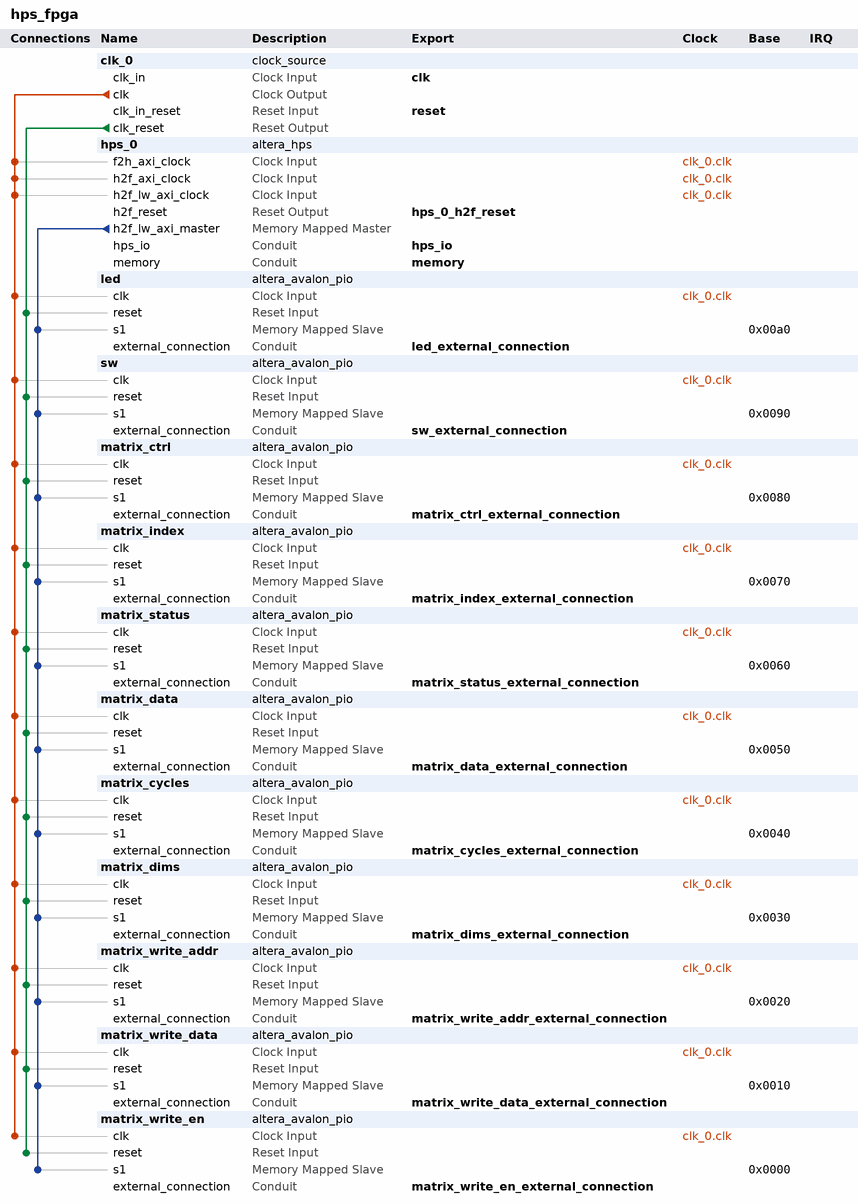
[diagram p0: system contents]
# Platform Designer (Qsys) system hps_fpga, Cyclone V 5CSEMA5F31C6
# Parameters at their usual value, and those the tool derives, are not listed.
package require -exact qsys 17.1
create_system hps_fpga
set_project_property DEVICE_FAMILY {Cyclone V}
set_project_property DEVICE 5CSEMA5F31C6

add_instance clk_0 clock_source 17.1
set_instance_parameter_value clk_0 clockFrequency 50000000

add_instance hps_0 altera_hps 17.1
set_instance_parameter_value hps_0 EMAC1_Mode RGMII
set_instance_parameter_value hps_0 EMAC1_PinMuxing {HPS I/O Set 0}
set_instance_parameter_value hps_0 F2SCLK_COLDRST_Enable false
set_instance_parameter_value hps_0 F2SCLK_DBGRST_Enable false
set_instance_parameter_value hps_0 F2SCLK_WARMRST_Enable false
set_instance_parameter_value hps_0 F2SINTERRUPT_Enable false
set_instance_parameter_value hps_0 F2S_Width 2
set_instance_parameter_value hps_0 FPGA_PERIPHERAL_OUTPUT_CLOCK_FREQ_EMAC0_GTX_CLK 100
set_instance_parameter_value hps_0 FPGA_PERIPHERAL_OUTPUT_CLOCK_FREQ_EMAC0_MD_CLK 100.0
set_instance_parameter_value hps_0 FPGA_PERIPHERAL_OUTPUT_CLOCK_FREQ_EMAC1_GTX_CLK 100
set_instance_parameter_value hps_0 FPGA_PERIPHERAL_OUTPUT_CLOCK_FREQ_EMAC1_MD_CLK 100.0
set_instance_parameter_value hps_0 HPS_PROTOCOL DDR3
set_instance_parameter_value hps_0 I2C0_Mode N/A
set_instance_parameter_value hps_0 I2C0_PinMuxing Unused
set_instance_parameter_value hps_0 I2C1_Mode N/A
set_instance_parameter_value hps_0 I2C1_PinMuxing Unused
set_instance_parameter_value hps_0 LWH2F_Enable true
set_instance_parameter_value hps_0 MEM_BANKADDR_WIDTH 3
set_instance_parameter_value hps_0 MEM_CLK_FREQ 400.0
set_instance_parameter_value hps_0 MEM_COL_ADDR_WIDTH 10
set_instance_parameter_value hps_0 MEM_DQ_WIDTH 32
set_instance_parameter_value hps_0 MEM_DRV_STR RZQ/7
set_instance_parameter_value hps_0 MEM_ROW_ADDR_WIDTH 15
set_instance_parameter_value hps_0 MEM_RTT_NOM RZQ/4
set_instance_parameter_value hps_0 MEM_RTT_WR {Dynamic ODT off}
set_instance_parameter_value hps_0 MEM_TCL 11
set_instance_parameter_value hps_0 MEM_TFAW_NS 30.0
set_instance_parameter_value hps_0 MEM_TRAS_NS 35.0
set_instance_parameter_value hps_0 MEM_TRCD_NS 13.75
set_instance_parameter_value hps_0 MEM_TRFC_NS 260.0
set_instance_parameter_value hps_0 MEM_TRP_NS 13.75
set_instance_parameter_value hps_0 MEM_VENDOR JEDEC
set_instance_parameter_value hps_0 MEM_WTCL 8
set_instance_parameter_value hps_0 QSPI_Mode N/A
set_instance_parameter_value hps_0 QSPI_PinMuxing Unused
set_instance_parameter_value hps_0 REF_CLK_FREQ 25.0
set_instance_parameter_value hps_0 S2FCLK_USER2CLK 5
set_instance_parameter_value hps_0 S2F_Width 2
set_instance_parameter_value hps_0 SDIO_Mode {4-bit Data}
set_instance_parameter_value hps_0 SDIO_PinMuxing {HPS I/O Set 0}
set_instance_parameter_value hps_0 SPIM1_Mode N/A
set_instance_parameter_value hps_0 SPIM1_PinMuxing Unused
set_instance_parameter_value hps_0 STM_Enable false
set_instance_parameter_value hps_0 TIMING_BOARD_AC_SKEW 0.03
set_instance_parameter_value hps_0 TIMING_BOARD_AC_TO_CK_SKEW 0.0
set_instance_parameter_value hps_0 TIMING_BOARD_DQ_TO_DQS_SKEW 0.0
set_instance_parameter_value hps_0 TIMING_BOARD_MAX_CK_DELAY 0.03
set_instance_parameter_value hps_0 TIMING_BOARD_MAX_DQS_DELAY 0.02
set_instance_parameter_value hps_0 TIMING_BOARD_SKEW_BETWEEN_DQS 0.08
set_instance_parameter_value hps_0 TIMING_BOARD_SKEW_CKDQS_DIMM_MAX 0.16
set_instance_parameter_value hps_0 TIMING_BOARD_SKEW_CKDQS_DIMM_MIN 0.09
set_instance_parameter_value hps_0 TIMING_BOARD_SKEW_WITHIN_DQS 0.01
set_instance_parameter_value hps_0 TIMING_TDH 65
set_instance_parameter_value hps_0 TIMING_TDQSCK 255
set_instance_parameter_value hps_0 TIMING_TDQSQ 125
set_instance_parameter_value hps_0 TIMING_TDS 30
set_instance_parameter_value hps_0 TIMING_TIH 140
set_instance_parameter_value hps_0 TIMING_TIS 180
set_instance_parameter_value hps_0 TIMING_TQSH 0.4
set_instance_parameter_value hps_0 UART0_Mode {No Flow Control}
set_instance_parameter_value hps_0 UART0_PinMuxing {HPS I/O Set 0}
set_instance_parameter_value hps_0 USB1_Mode SDR
set_instance_parameter_value hps_0 USB1_PinMuxing {HPS I/O Set 0}
set_instance_parameter_value hps_0 desired_cfg_clk_mhz 100.0
set_instance_parameter_value hps_0 desired_qspi_clk_mhz 400.0

add_instance led altera_avalon_pio 17.1
set_instance_parameter_value led direction Output
set_instance_parameter_value led resetValue 1023
set_instance_parameter_value led width 10

add_instance sw altera_avalon_pio 17.1
set_instance_parameter_value sw direction Input
set_instance_parameter_value sw width 10

add_instance matrix_ctrl altera_avalon_pio 17.1
set_instance_parameter_value matrix_ctrl direction Output
set_instance_parameter_value matrix_ctrl width 32

add_instance matrix_index altera_avalon_pio 17.1
set_instance_parameter_value matrix_index direction Output
set_instance_parameter_value matrix_index width 6

add_instance matrix_status altera_avalon_pio 17.1
set_instance_parameter_value matrix_status direction Input
set_instance_parameter_value matrix_status width 32

add_instance matrix_data altera_avalon_pio 17.1
set_instance_parameter_value matrix_data direction Input
set_instance_parameter_value matrix_data width 32

add_instance matrix_cycles altera_avalon_pio 17.1
set_instance_parameter_value matrix_cycles direction Input
set_instance_parameter_value matrix_cycles width 32

add_instance matrix_dims altera_avalon_pio 17.1
set_instance_parameter_value matrix_dims direction Output
set_instance_parameter_value matrix_dims width 32

add_instance matrix_write_addr altera_avalon_pio 17.1
set_instance_parameter_value matrix_write_addr direction Output
set_instance_parameter_value matrix_write_addr width 32

add_instance matrix_write_data altera_avalon_pio 17.1
set_instance_parameter_value matrix_write_data direction Output
set_instance_parameter_value matrix_write_data width 32

add_instance matrix_write_en altera_avalon_pio 17.1
set_instance_parameter_value matrix_write_en direction Output
set_instance_parameter_value matrix_write_en width 31

# connections
add_connection clk_0.clk hps_0.f2h_axi_clock clock
add_connection clk_0.clk hps_0.h2f_axi_clock clock
add_connection clk_0.clk hps_0.h2f_lw_axi_clock clock
add_connection clk_0.clk led.clk clock
add_connection clk_0.clk matrix_ctrl.clk clock
add_connection clk_0.clk matrix_cycles.clk clock
add_connection clk_0.clk matrix_data.clk clock
add_connection clk_0.clk matrix_dims.clk clock
add_connection clk_0.clk matrix_index.clk clock
add_connection clk_0.clk matrix_status.clk clock
add_connection clk_0.clk matrix_write_addr.clk clock
add_connection clk_0.clk matrix_write_data.clk clock
add_connection clk_0.clk matrix_write_en.clk clock
add_connection clk_0.clk sw.clk clock
add_connection clk_0.clk_reset led.reset reset
add_connection clk_0.clk_reset matrix_ctrl.reset reset
add_connection clk_0.clk_reset matrix_cycles.reset reset
add_connection clk_0.clk_reset matrix_data.reset reset
add_connection clk_0.clk_reset matrix_dims.reset reset
add_connection clk_0.clk_reset matrix_index.reset reset
add_connection clk_0.clk_reset matrix_status.reset reset
add_connection clk_0.clk_reset matrix_write_addr.reset reset
add_connection clk_0.clk_reset matrix_write_data.reset reset
add_connection clk_0.clk_reset matrix_write_en.reset reset
add_connection clk_0.clk_reset sw.reset reset
add_connection hps_0.h2f_lw_axi_master led.s1 avalon
set_connection_parameter_value hps_0.h2f_lw_axi_master/led.s1 baseAddress 0x00a0
add_connection hps_0.h2f_lw_axi_master matrix_ctrl.s1 avalon
set_connection_parameter_value hps_0.h2f_lw_axi_master/matrix_ctrl.s1 baseAddress 0x0080
add_connection hps_0.h2f_lw_axi_master matrix_cycles.s1 avalon
set_connection_parameter_value hps_0.h2f_lw_axi_master/matrix_cycles.s1 baseAddress 0x0040
add_connection hps_0.h2f_lw_axi_master matrix_data.s1 avalon
set_connection_parameter_value hps_0.h2f_lw_axi_master/matrix_data.s1 baseAddress 0x0050
add_connection hps_0.h2f_lw_axi_master matrix_dims.s1 avalon
set_connection_parameter_value hps_0.h2f_lw_axi_master/matrix_dims.s1 baseAddress 0x0030
add_connection hps_0.h2f_lw_axi_master matrix_index.s1 avalon
set_connection_parameter_value hps_0.h2f_lw_axi_master/matrix_index.s1 baseAddress 0x0070
add_connection hps_0.h2f_lw_axi_master matrix_status.s1 avalon
set_connection_parameter_value hps_0.h2f_lw_axi_master/matrix_status.s1 baseAddress 0x0060
add_connection hps_0.h2f_lw_axi_master matrix_write_addr.s1 avalon
set_connection_parameter_value hps_0.h2f_lw_axi_master/matrix_write_addr.s1 baseAddress 0x0020
add_connection hps_0.h2f_lw_axi_master matrix_write_data.s1 avalon
set_connection_parameter_value hps_0.h2f_lw_axi_master/matrix_write_data.s1 baseAddress 0x0010
add_connection hps_0.h2f_lw_axi_master matrix_write_en.s1 avalon
set_connection_parameter_value hps_0.h2f_lw_axi_master/matrix_write_en.s1 baseAddress 0x0000
add_connection hps_0.h2f_lw_axi_master sw.s1 avalon
set_connection_parameter_value hps_0.h2f_lw_axi_master/sw.s1 baseAddress 0x0090

# exported interfaces
add_interface clk clock sink
set_interface_property clk EXPORT_OF clk_0.clk_in
add_interface hps_0_h2f_reset reset source
set_interface_property hps_0_h2f_reset EXPORT_OF hps_0.h2f_reset
add_interface hps_io conduit end
set_interface_property hps_io EXPORT_OF hps_0.hps_io
add_interface led_external_connection conduit end
set_interface_property led_external_connection EXPORT_OF led.external_connection
add_interface matrix_ctrl_external_connection conduit end
set_interface_property matrix_ctrl_external_connection EXPORT_OF matrix_ctrl.external_connection
add_interface matrix_cycles_external_connection conduit end
set_interface_property matrix_cycles_external_connection EXPORT_OF matrix_cycles.external_connection
add_interface matrix_data_external_connection conduit end
set_interface_property matrix_data_external_connection EXPORT_OF matrix_data.external_connection
add_interface matrix_dims_external_connection conduit end
set_interface_property matrix_dims_external_connection EXPORT_OF matrix_dims.external_connection
add_interface matrix_index_external_connection conduit end
set_interface_property matrix_index_external_connection EXPORT_OF matrix_index.external_connection
add_interface matrix_status_external_connection conduit end
set_interface_property matrix_status_external_connection EXPORT_OF matrix_status.external_connection
add_interface matrix_write_addr_external_connection conduit end
set_interface_property matrix_write_addr_external_connection EXPORT_OF matrix_write_addr.external_connection
add_interface matrix_write_data_external_connection conduit end
set_interface_property matrix_write_data_external_connection EXPORT_OF matrix_write_data.external_connection
add_interface matrix_write_en_external_connection conduit end
set_interface_property matrix_write_en_external_connection EXPORT_OF matrix_write_en.external_connection
add_interface memory conduit end
set_interface_property memory EXPORT_OF hps_0.memory
add_interface reset reset sink
set_interface_property reset EXPORT_OF clk_0.clk_in_reset
add_interface sw_external_connection conduit end
set_interface_property sw_external_connection EXPORT_OF sw.external_connection

set_interconnect_requirement {$system} qsys_mm.clockCrossingAdapter HANDSHAKE
set_interconnect_requirement {$system} qsys_mm.insertDefaultSlave FALSE
set_interconnect_requirement {$system} qsys_mm.maxAdditionalLatency 1

save_system hps_fpga.qsys
